# EAGLE design brushless (EAGLE 6.1)

## Sheet 1 of 2
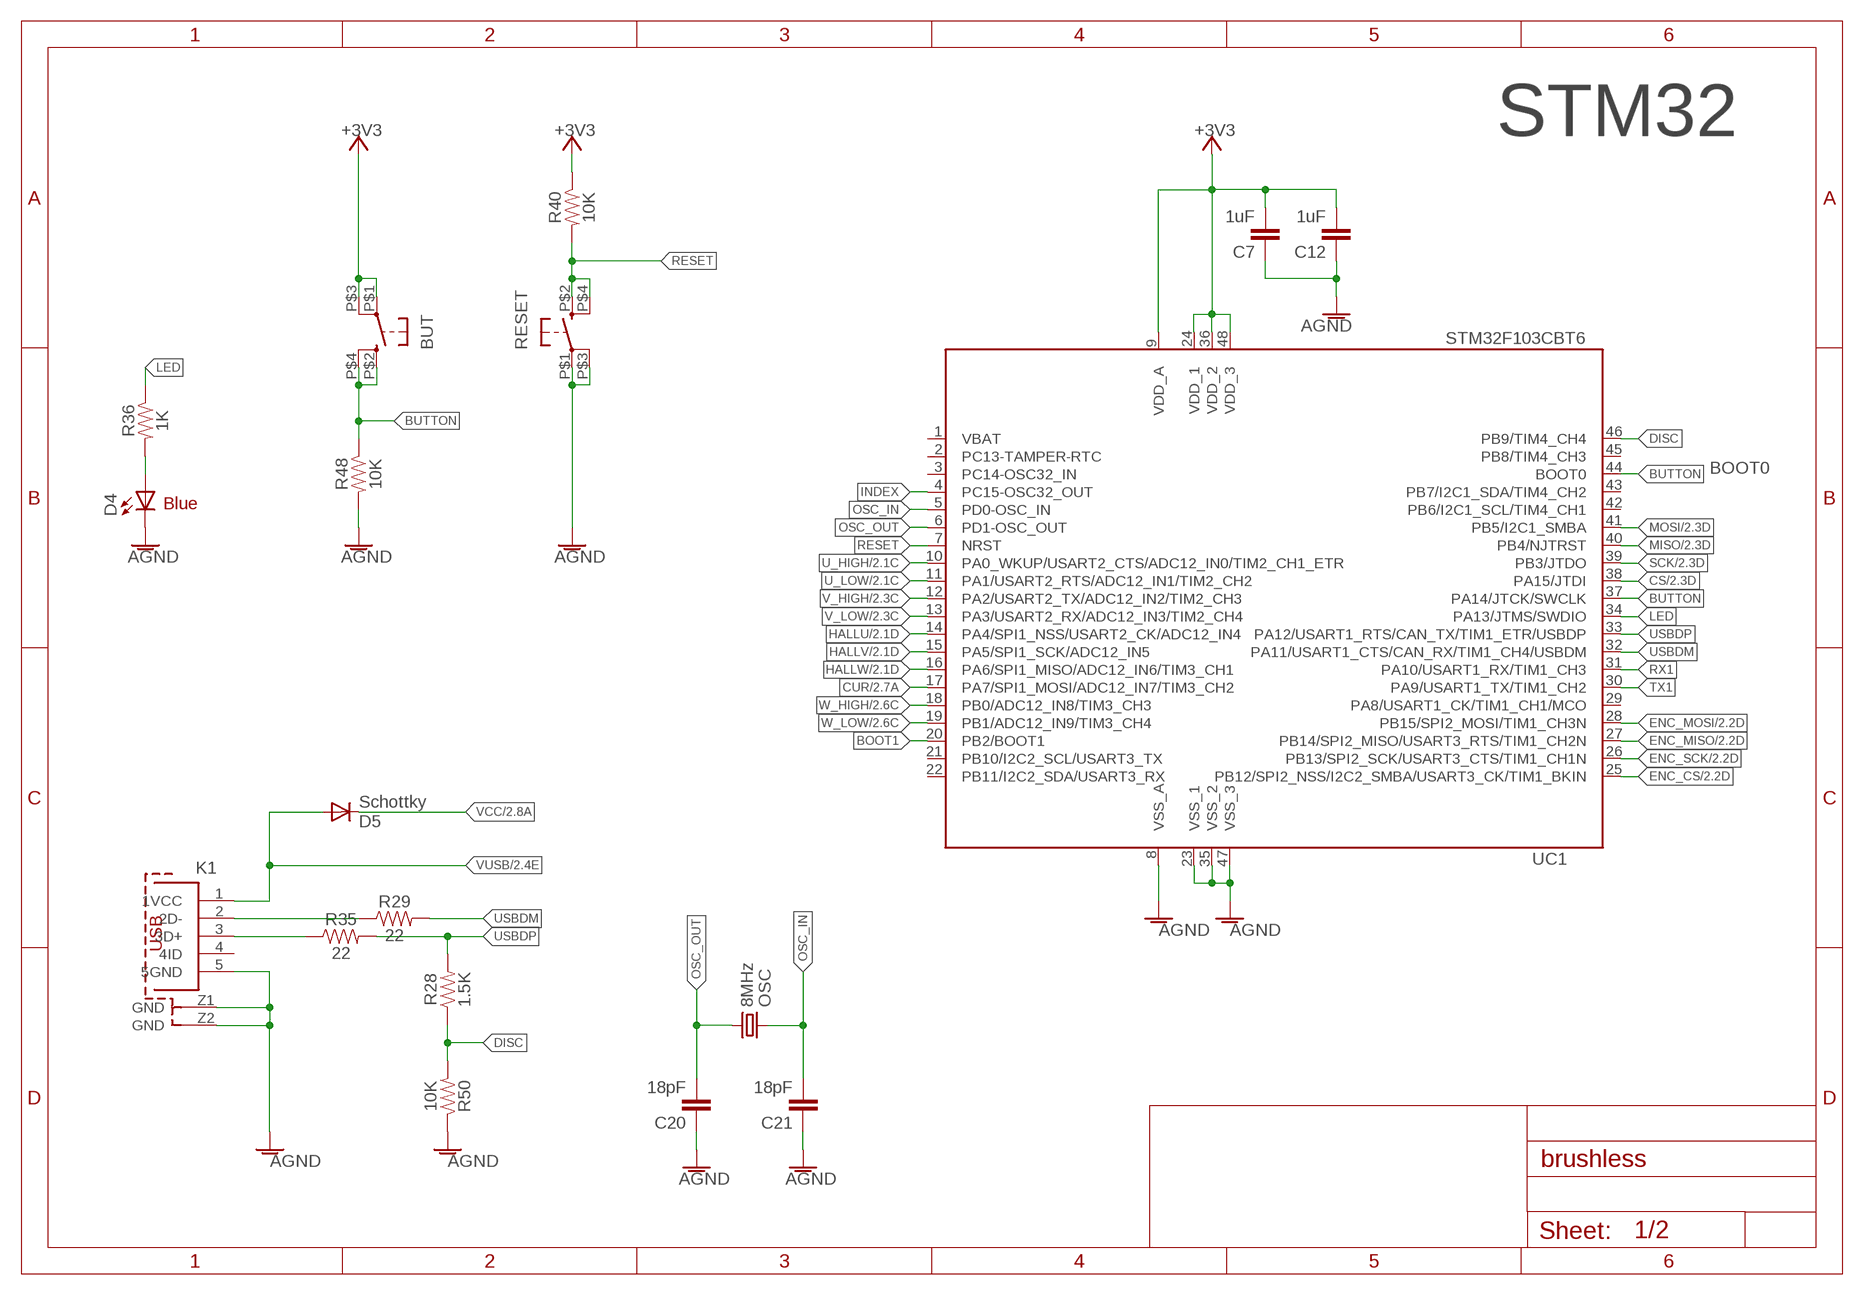
[diagram p0: schematic, sheet 1]

### Parts
BUT  KMR211GLFS  BUTTON-KMR241GLFS  [PUSHBUTTON-KMR241GLFS]
C7  1uF  CAP0805  [0805@1]
C12  1uF  CAP0805  [0805@1]
C20  18pF  CAP0805  [0805@1]
C21  18pF  CAP0805  [0805@1]
D4  Blue  LED1206  [LED-1206]
D5  Schottky  DIODESOD  [SOD-323]
K1  614105150721  [614105150721]
OSC  8MHz  CRYSTAL5X3  [CRYSTAL-SMD-5X3]
R28  1.5K  RESISTOR0805  [0805]
R29  22  RESISTOR0805  [0805]
R35  22  RESISTOR0805  [0805]
R36  1K  RESISTOR0805  [0805]
R40  10K  RESISTOR0805  [0805]
R48  10K  RESISTOR0805  [0805]
R50  10K  RESISTOR0805  [0805]
RESET  KMR211GLFS  BUTTON-KMR241GLFS  [PUSHBUTTON-KMR241GLFS]
UC1  STM32F103CBT6  STM32_STM32F103CB  [STM32_LQFP48]

### Nets
+3V3: BUT.P$1 BUT.P$3 C7.2 C12.2 R40.1 UC1.9(VDD_A) UC1.24(VDD_1) UC1.36(VDD_2) UC1.48(VDD_3) ; also sheet 2
AGND: C7.1 C12.1 C20.1 C21.1 D4.C K1.5(5GND) K1.Z1(GND) K1.Z2(GND) R48.2 R50.1 RESET.P$1 RESET.P$3 UC1.8(VSS_A) UC1.23(VSS_1) UC1.35(VSS_2) UC1.47(VSS_3) ; also sheet 2
BOOT1: UC1.20(PB2/BOOT1)
BUTTON: BUT.P$2 BUT.P$4 R48.1 UC1.37(PA14/JTCK/SWCLK) UC1.44(BOOT0)
CS: UC1.38(PA15/JTDI) ; also sheet 2
CUR: UC1.17(PA7/SPI1_MOSI/ADC12_IN7/TIM3_CH2) ; also sheet 2
DISC: R28.1 R50.2 UC1.46(PB9/TIM4_CH4)
ENC_CS: UC1.25(PB12/SPI2_NSS/I2C2_SMBA/USART3_CK/TIM1_BKIN) ; also sheet 2
ENC_MISO: UC1.27(PB14/SPI2_MISO/USART3_RTS/TIM1_CH2N) ; also sheet 2
ENC_MOSI: UC1.28(PB15/SPI2_MOSI/TIM1_CH3N) ; also sheet 2
ENC_SCK: UC1.26(PB13/SPI2_SCK/USART3_CTS/TIM1_CH1N) ; also sheet 2
HALLU: UC1.14(PA4/SPI1_NSS/USART2_CK/ADC12_IN4) ; also sheet 2
HALLV: UC1.15(PA5/SPI1_SCK/ADC12_IN5) ; also sheet 2
HALLW: UC1.16(PA6/SPI1_MISO/ADC12_IN6/TIM3_CH1) ; also sheet 2
INDEX: UC1.4(PC15-OSC32_OUT)
LED: R36.1 UC1.34(PA13/JTMS/SWDIO)
MISO: UC1.40(PB4/NJTRST) ; also sheet 2
MOSI: UC1.41(PB5/I2C1_SMBA) ; also sheet 2
N$29: D4.A R36.2
N$59: K1.2(2D-) R29.1
N$60: K1.3(3D+) R35.1
OSC_IN: C21.2 OSC.3 UC1.5(PD0-OSC_IN)
OSC_OUT: C20.2 OSC.1 UC1.6(PD1-OSC_OUT)
RESET: R40.2 RESET.P$2 RESET.P$4 UC1.7(NRST)
RX1: UC1.31(PA10/USART1_RX/TIM1_CH3)
SCK: UC1.39(PB3/JTDO) ; also sheet 2
TX1: UC1.30(PA9/USART1_TX/TIM1_CH2)
U_HIGH: UC1.10(PA0_WKUP/USART2_CTS/ADC12_IN0/TIM2_CH1_ETR) ; also sheet 2
U_LOW: UC1.11(PA1/USART2_RTS/ADC12_IN1/TIM2_CH2) ; also sheet 2
USBDM: R29.2 UC1.32(PA11/USART1_CTS/CAN_RX/TIM1_CH4/USBDM)
USBDP: R28.2 R35.2 UC1.33(PA12/USART1_RTS/CAN_TX/TIM1_ETR/USBDP)
V_HIGH: UC1.12(PA2/USART2_TX/ADC12_IN2/TIM2_CH3) ; also sheet 2
V_LOW: UC1.13(PA3/USART2_RX/ADC12_IN3/TIM2_CH4) ; also sheet 2
VCC: D5.1(C) ; also sheet 2
VUSB: D5.2(A) K1.1(1VCC) ; also sheet 2
W_HIGH: UC1.18(PB0/ADC12_IN8/TIM3_CH3) ; also sheet 2
W_LOW: UC1.19(PB1/ADC12_IN9/TIM3_CH4) ; also sheet 2
Unconnected: K1.4(4ID) UC1.2(PC13-TAMPER-RTC) UC1.3(PC14-OSC32_IN) UC1.21(PB10/I2C2_SCL/USART3_TX) UC1.22(PB11/I2C2_SDA/USART3_RX) UC1.29(PA8/USART1_CK/TIM1_CH1/MCO) UC1.42(PB6/I2C1_SCL/TIM4_CH1) UC1.43(PB7/I2C1_SDA/TIM4_CH2) UC1.45(PB8/TIM4_CH3)

### Notes on the sheet
- STM32
- BOOT0
- Blue

## Sheet 2 of 2
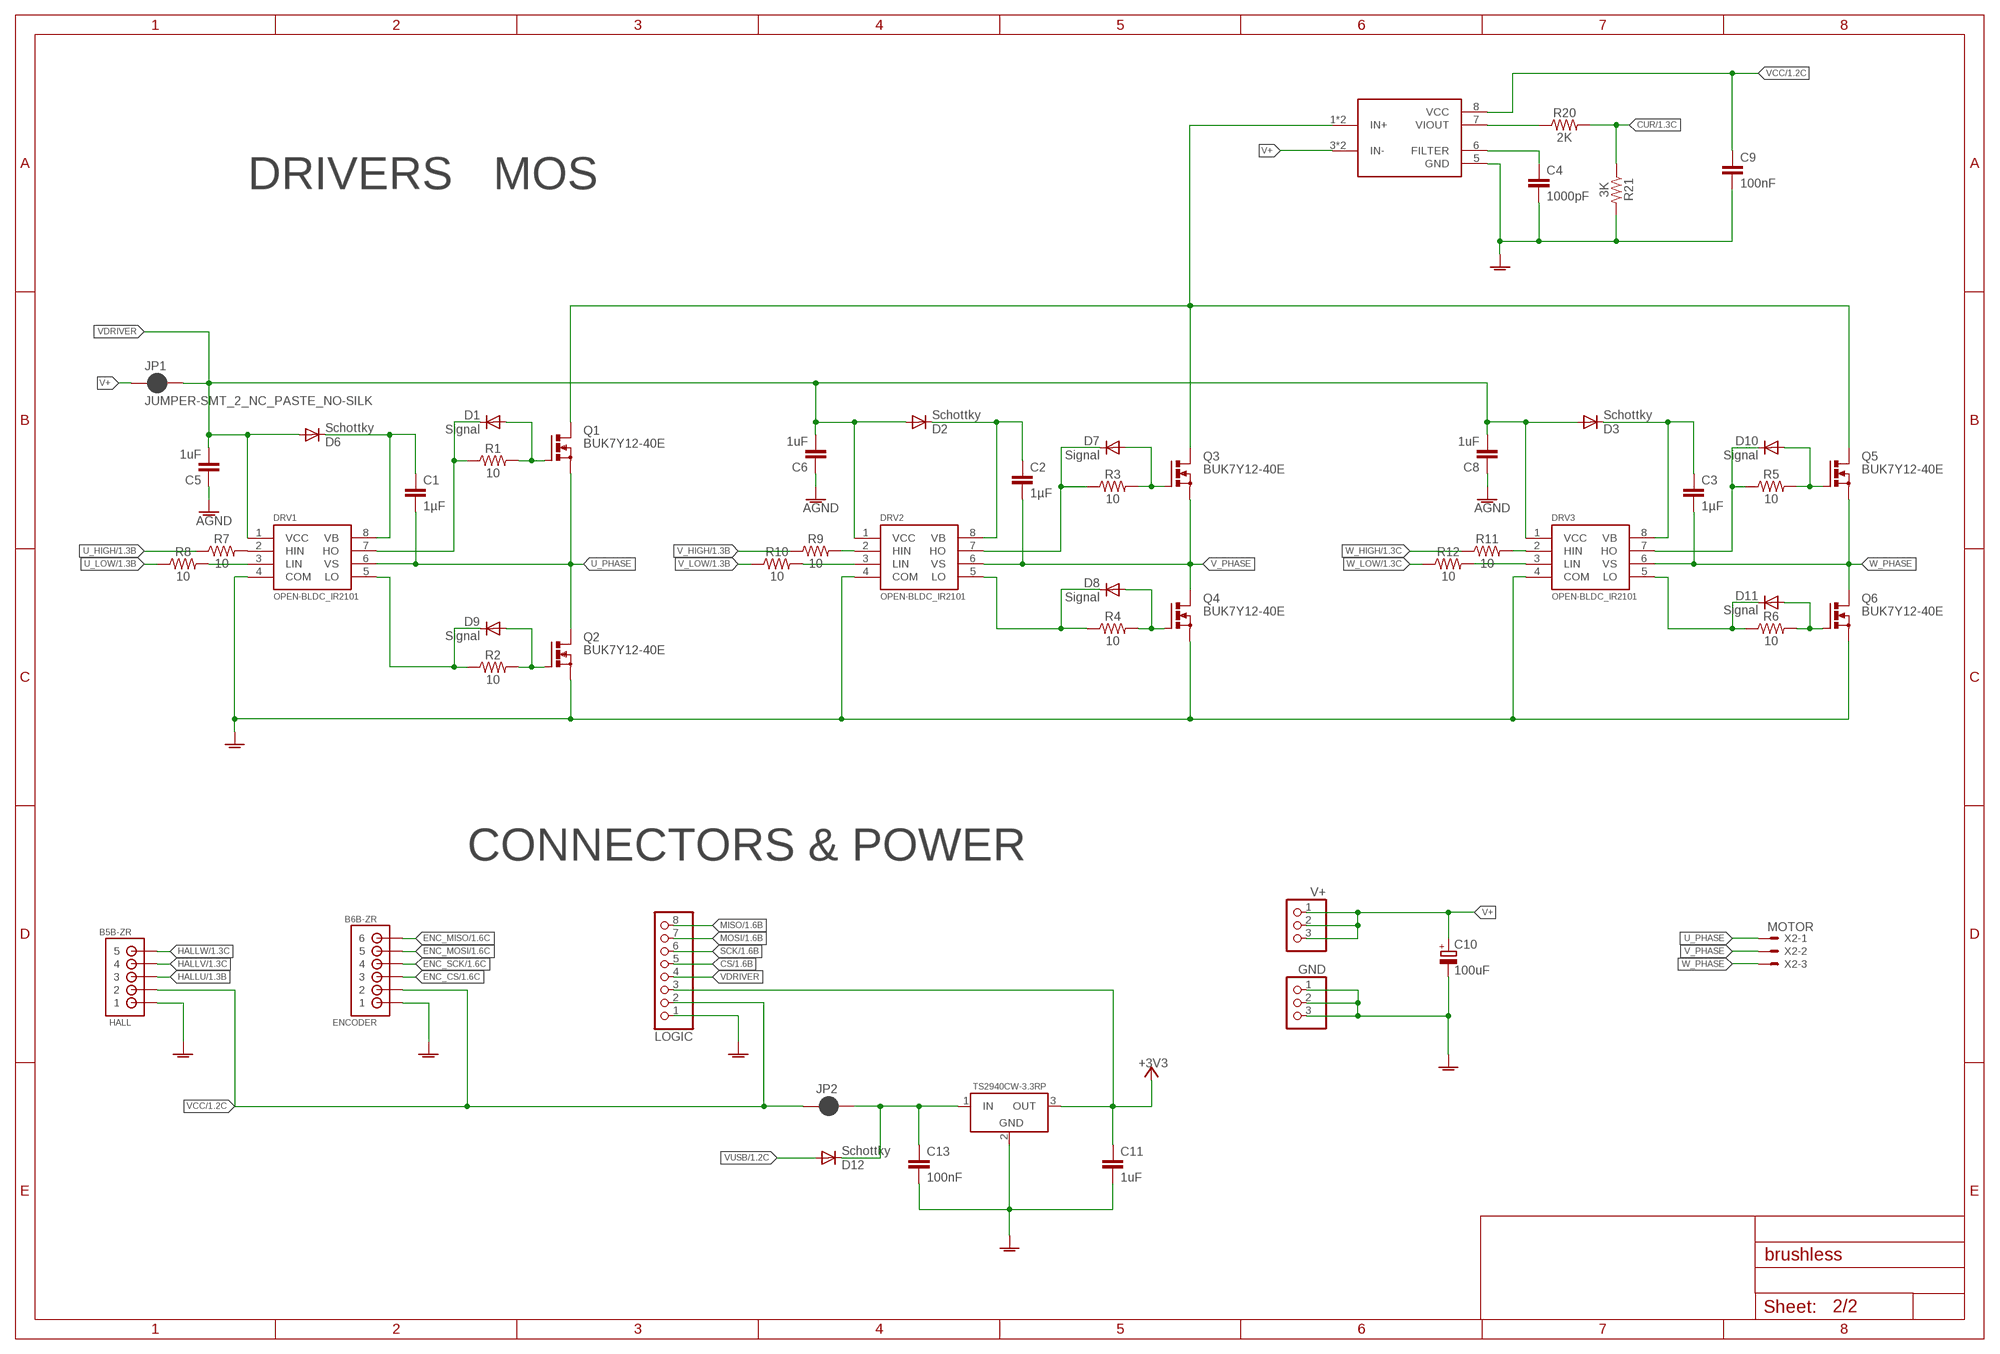
[diagram p1: schematic, sheet 2]

### Parts
C1  1µF  0.33UF/330NF-0805-50V-10%  [0805]
C2  1µF  0.33UF/330NF-0805-50V-10%  [0805]
C3  1µF  0.33UF/330NF-0805-50V-10%  [0805]
C4  1000pF  CAP0805  [0805@1]
C5  1uF  CAP0805  [0805@1]
C6  1uF  CAP0805  [0805@1]
C8  1uF  CAP0805  [0805@1]
C9  100nF  CAP0805  [0805@1]
C10  100uF  CPOL_EU_3.5-8  [E3,5-8]
C11  1uF  CAP0805  [0805@1]
C13  100nF  CAP0805  [0805@1]
D1  Signal  DIODESOD  [SOD-323]
D2  Schottky  DIODESOD  [SOD-323]
D3  Schottky  DIODESOD  [SOD-323]
D6  Schottky  DIODESOD  [SOD-323]
D7  Signal  DIODESOD  [SOD-323]
D8  Signal  DIODESOD  [SOD-323]
D9  Signal  DIODESOD  [SOD-323]
D10  Signal  DIODESOD  [SOD-323]
D11  Signal  DIODESOD  [SOD-323]
D12  Schottky  DIODESOD  [SOD-323]
DRV1  OPEN-BLDC_IR2101  [OPEN-BLDC_SO-8]
DRV2  OPEN-BLDC_IR2101  [OPEN-BLDC_SO-8]
DRV3  OPEN-BLDC_IR2101  [OPEN-BLDC_SO-8]
ENCODER  B6B-ZR  [B6B-ZR]
GND  CONNEC_1X03  [CONNEC_1X03]
HALL  B5B-ZR  [B5B-ZR]
JP1  JUMPER-SMT_2_NC_PASTE_NO-SILK  [SMT-JUMPER_2_NC_PASTE_NO-SILK]
JP2  JUMPER-SMT_2_NC_PASTE_NO-SILK  [SMT-JUMPER_2_NC_PASTE_NO-SILK]
LOGIC  CONNEC_1X08  [CONNEC_1X08]
Q1  BUK7Y12-40E  [SOT669]
Q2  BUK7Y12-40E  [SOT669]
Q3  BUK7Y12-40E  [SOT669]
Q4  BUK7Y12-40E  [SOT669]
Q5  BUK7Y12-40E  [SOT669]
Q6  BUK7Y12-40E  [SOT669]
R1  10  RESISTOR0805  [0805]
R2  10  RESISTOR0805  [0805]
R3  10  RESISTOR0805  [0805]
R4  10  RESISTOR0805  [0805]
R5  10  RESISTOR0805  [0805]
R6  10  RESISTOR0805  [0805]
R7  10  RESISTOR0805  [0805]
R8  10  RESISTOR0805  [0805]
R9  10  RESISTOR0805  [0805]
R10  10  RESISTOR0805  [0805]
R11  10  RESISTOR0805  [0805]
R12  10  RESISTOR0805  [0805]
R20  2K  RESISTOR0805  [0805]
R21  3K  RESISTOR0805  [0805]
REG1  TS2940CW-3.3RP  [SOT223]
SENSE  ACS712  [SO8]
V+  CONNEC_1X03  [CONNEC_1X03]
X2  MOTOR  JST-XH-03-PIN-LONG-PAD  [JST-XH-03-PACKAGE-LONG-PAD]

### Nets
+3V3: C11.1 LOGIC.3 REG1.3(OUT) ; also sheet 1
AGND: C4.2 C5.1 C6.1 C8.1 C9.2 C10.- C11.2 C13.2 DRV1.4(COM) DRV2.4(COM) DRV3.4(COM) ENCODER.1 GND.1 GND.2 GND.3 HALL.1 LOGIC.1 Q2.1(S) Q2.2(S) Q2.3(S) Q4.1(S) Q4.2(S) Q4.3(S) Q6.1(S) Q6.2(S) Q6.3(S) R21.2 REG1.2(GND) SENSE.5(GND) ; also sheet 1
CS: LOGIC.5 ; also sheet 1
CUR: R20.2 R21.1 ; also sheet 1
ENC_CS: ENCODER.3 ; also sheet 1
ENC_MISO: ENCODER.6 ; also sheet 1
ENC_MOSI: ENCODER.5 ; also sheet 1
ENC_SCK: ENCODER.4 ; also sheet 1
HALLU: HALL.3 ; also sheet 1
HALLV: HALL.4 ; also sheet 1
HALLW: HALL.5 ; also sheet 1
MISO: LOGIC.8 ; also sheet 1
MOSI: LOGIC.7 ; also sheet 1
N$2: D7.2(A) Q3.4(G) R3.2
N$3: D9.2(A) Q2.4(G) R2.2
N$4: DRV1.2(HIN) R7.2
N$5: C1.1 D6.1(C) DRV1.8(VB)
N$6: D8.2(A) Q4.4(G) R4.2
N$7: D10.2(A) Q5.4(G) R5.2
N$8: DRV1.3(LIN) R8.2
N$9: D11.2(A) Q6.4(G) R6.2
N$10: C2.1 D2.1(C) DRV2.8(VB)
N$11: D1.2(A) Q1.4(G) R1.2
N$12: D10.1(C) DRV3.7(HO) R5.1
N$13: D11.1(C) DRV3.5(LO) R6.1
N$14: DRV2.3(LIN) R10.2
N$15: C3.1 D3.1(C) DRV3.8(VB)
N$16: DRV2.2(HIN) R9.2
N$17: DRV3.2(HIN) R11.2
N$18: DRV3.3(LIN) R12.2
N$22: C13.1 D12.1(C) JP2.2 REG1.1(IN)
N$24: R20.1 SENSE.7(VIOUT)
N$27: C4.1 SENSE.6(FILTER)
SCK: LOGIC.6 ; also sheet 1
U_GATE_HIGH: D1.1(C) DRV1.7(HO) R1.1
U_GATE_LOW: D9.1(C) DRV1.5(LO) R2.1
U_HIGH: R7.1 ; also sheet 1
U_LOW: R8.1 ; also sheet 1
U_PHASE [power]: C1.2 DRV1.6(VS) Q1.1(S) Q1.2(S) Q1.3(S) Q2.MB(D) X2.1
V+ [vdriver]: C10.+ JP1.1 SENSE.3(IN-) SENSE.4(IN-) V+.1 V+.2 V+.3
V+_MOS [power]: Q1.MB(D) Q3.MB(D) Q5.MB(D) SENSE.1(IN+) SENSE.2(IN+)
V_GATE_HIGH: D7.1(C) DRV2.7(HO) R3.1
V_GATE_LOW: D8.1(C) DRV2.5(LO) R4.1
V_HIGH: R9.1 ; also sheet 1
V_LOW: R10.1 ; also sheet 1
V_PHASE [power]: C2.2 DRV2.6(VS) Q3.1(S) Q3.2(S) Q3.3(S) Q4.MB(D) X2.2
VCC: C9.1 ENCODER.2 HALL.2 JP2.1 LOGIC.2 SENSE.8(VCC) ; also sheet 1
VDRIVER [vdriver]: C5.2 C6.2 C8.2 D2.2(A) D3.2(A) D6.2(A) DRV1.1(VCC) DRV2.1(VCC) DRV3.1(VCC) JP1.2 LOGIC.4
VUSB: D12.2(A) ; also sheet 1
W_HIGH: R11.1 ; also sheet 1
W_LOW: R12.1 ; also sheet 1
W_PHASE [power]: C3.2 DRV3.6(VS) Q5.1(S) Q5.2(S) Q5.3(S) Q6.MB(D) X2.3

### Notes on the sheet
- DRIVERS | MOS
- CONNECTORS & POWER

## Power pins joined to a net without a drawn wire
VBAT: UC1.1(VBAT)

## Library data of the parts
BUT RESET = okie:BUTTON-KMR241GLFS; FARNELL: 1437637
C1-C3 = SparkFun-Capacitors:0.33UF/330NF: 0.33µF/330nF ceramic capacitors A capacitor is a passive two-terminal electrical component used to store electrical energy temporarily in an electric field.; FARNELL: 2496946; PROD_ID: CAP-08469; VALUE: 0.33µF
C4 = SparkFun-Passives:CAP: Capacitor Standard 0603 ceramic capacitor, and 0.1" leaded capacitor.; FARNELL: 2392334
C5-C8 C11 C12 = SparkFun-Passives:CAP: Capacitor Standard 0603 ceramic capacitor, and 0.1" leaded capacitor.; FARNELL: 2496946
C9 C13 = SparkFun-Passives:CAP: Capacitor Standard 0603 ceramic capacitor, and 0.1" leaded capacitor.; FARNELL: 1759143RL
C10 = rhoban:CPOL_EU: 47uF: http://fr.farnell.com/panasonic-electronic-components/eee1ca470sp/condensateur-elec-alu-47uf-16v/dp/9696946 220uF: http://fr.farnell.com/panasonic-electronic-components/eeefk1c221xp/condensateur-elec-alu-220uf-16v/dp/1850103; FARNELL: 1870964
C20 C21 = SparkFun-Passives:CAP: Capacitor Standard 0603 ceramic capacitor, and 0.1" leaded capacitor.; FARNELL: 1414620
D1 D7-D11 = SparkFun-DiscreteSemi:DIODE: Diode These are standard reverse protection diodes and small signal diodes. SMA package can handle up to about 1A. SOD-323 can handle about 200mA. What the SOD-323 package when ordering, there are some mfgs out there that are 5-pin packages.; FARNELL: 1843678RL
D2 D3 D5 D6 D12 = SparkFun-DiscreteSemi:DIODE: Diode These are standard reverse protection diodes and small signal diodes. SMA package can handle up to about 1A. SOD-323 can handle about 200mA. What the SOD-323 package when ordering, there are some mfgs out there that are 5-pin packages.; FARNELL: 8734593
D4 = SparkFun:LED: LEDs Standard schematic elements and footprints for 5mm, 3mm, 1206, and 0603 sized LEDs. 5mm - Spark Fun Electronics SKU : COM-00529 (and others); FARNELL: 1581233
DRV1-DRV3 = rhoban:OPEN-BLDC_IR2101; FARNELL: 8638756
ENCODER = jst:B6B-ZR: JST-ZH Connector 6 pol, 1.5mm pitch Package: B6B-ZR Source: http://www.jst-mfg.com/product/pdf/eng/eZH.pdf; FARNELL: -
GND V+ = rhoban:CONNEC_1X03; FARNELL: 1022248
HALL = jst:B5B-ZR: JST-ZH Connector 5 pol, 1.5mm pitch Package: B5B-ZR Source: http://www.jst-mfg.com/product/pdf/eng/eZH.pdf; FARNELL: -
JP1 JP2 = SparkFun-Jumpers:JUMPER-SMT_2_NC_PASTE: Normally closed solder jumper This jumper has an aperture in the stencil to allow solder paste to bridge the split in the wire so it's normally closed (NC). Wick off the solder to open the connection. Reapply solder to reclose the connection.; FARNELL: -
K1 = rhoban:614105150721: WR-COM_USB_Micro Type B_Vertical_THT; Micro Type B Vertical THT- Tape & Reel not for Pick & Place machine Code : Con_I-O_COM_USB_2.0_B_614105150721_614105150721 <http://katalog.we-online.de/media/images/eican/Con_I-O_COM_USB_2.0_B_614105150721_pf2.jpg> Details see: http://katalog.we-online.de/em/datasheet/614105150721.pdf Created 12/08/2014, Dan Xu 2014 (C) Wurth Elektronik; FARNELL: 2470821
LOGIC = rhoban:CONNEC_1X08; FARNELL: 1022256
OSC = SparkFun2:CRYSTAL: Crystals Various standard crystals. Proven footprints. Spark Fun Electronics SKU : COM-00534; FARNELL: 2467818
Q1-Q6 = transistor-power:BUK7Y12-40E; FARNELL: 2319916
R1-R12 = SparkFun-Resistors:RESISTOR: Generic Resistor Package; FARNELL: 2498048
R20 = SparkFun-Resistors:RESISTOR: Generic Resistor Package; FARNELL: 2446939
R21 = SparkFun-Resistors:RESISTOR: Generic Resistor Package; FARNELL: 2446965
R28 = SparkFun-Resistors:RESISTOR: Generic Resistor Package; FARNELL: 2446909
R29 R35 = SparkFun-Resistors:RESISTOR: Generic Resistor Package; FARNELL: 2446926
R36 = SparkFun-Resistors:RESISTOR: Generic Resistor Package; FARNELL: 2446904
R40 R48 R50 = SparkFun-Resistors:RESISTOR: Generic Resistor Package; FARNELL: 2447553
REG1 = rhoban:TS2940CW-3.3RP; FARNELL: 7261403
SENSE = rhoban:ACS712; FARNELL: 1329624
UC1 = rhoban:STM32_STM32F103CB; FARNELL: 1606327
X2 = Rembrandt Electronics - JST XH Connectors v1-0:JST-XH-03-PIN: JST XH Connector 2 Pin Wire to board connector. Pitch: 2,54 mm, (0.100") Number of pins: 3 Created by Rembrandt Electronics www.rembrandtelectronics.com; FARNELL: -

## Net classes
1 vdriver: width 0.254 mm

## Board
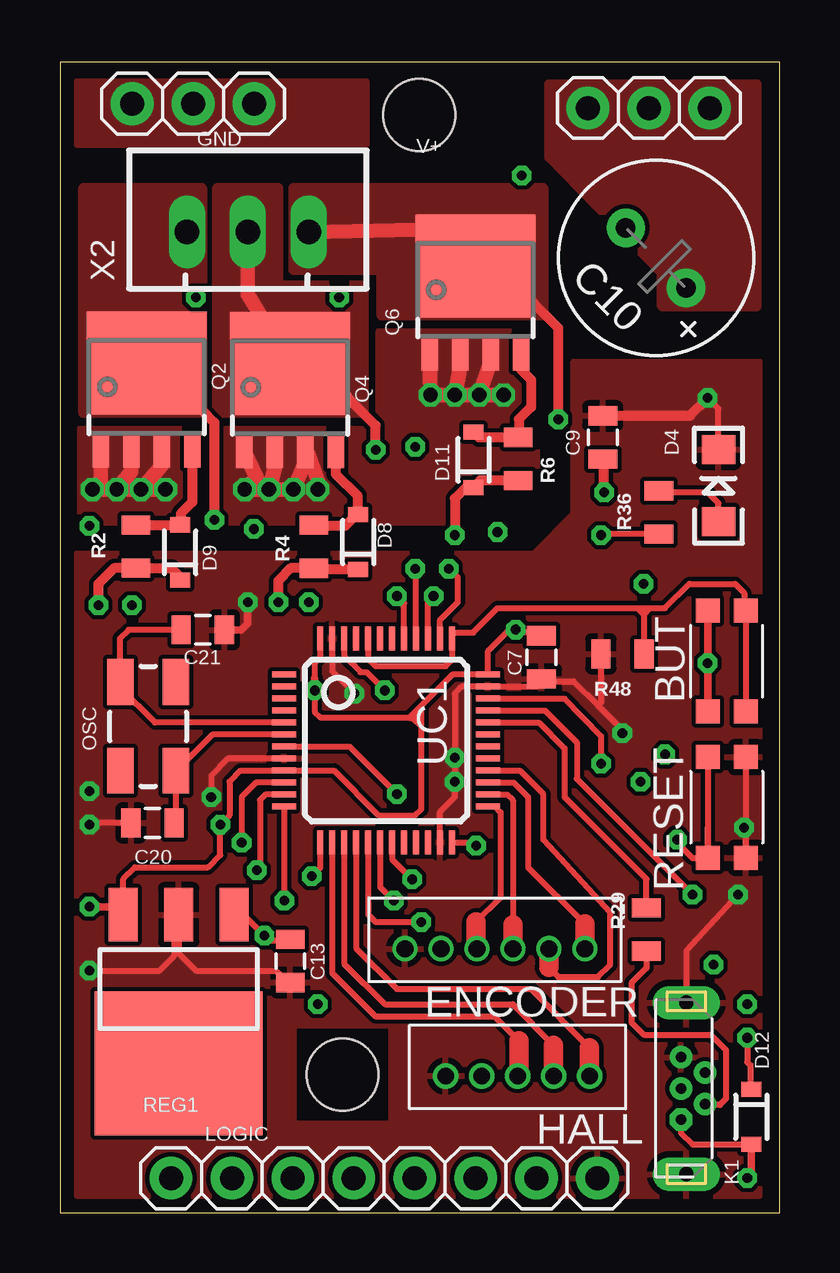
[diagram p2: board, top side]
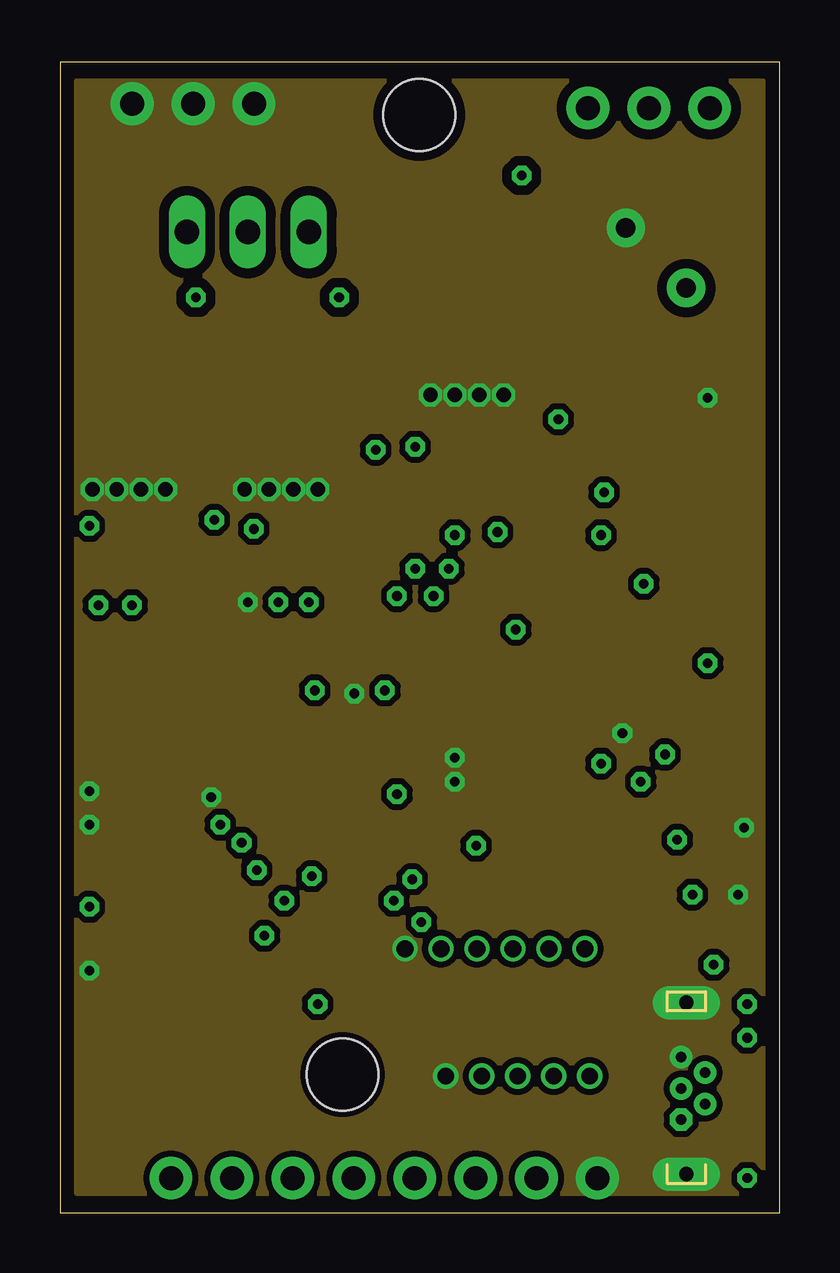
[diagram p3: board, inner layer Route2]
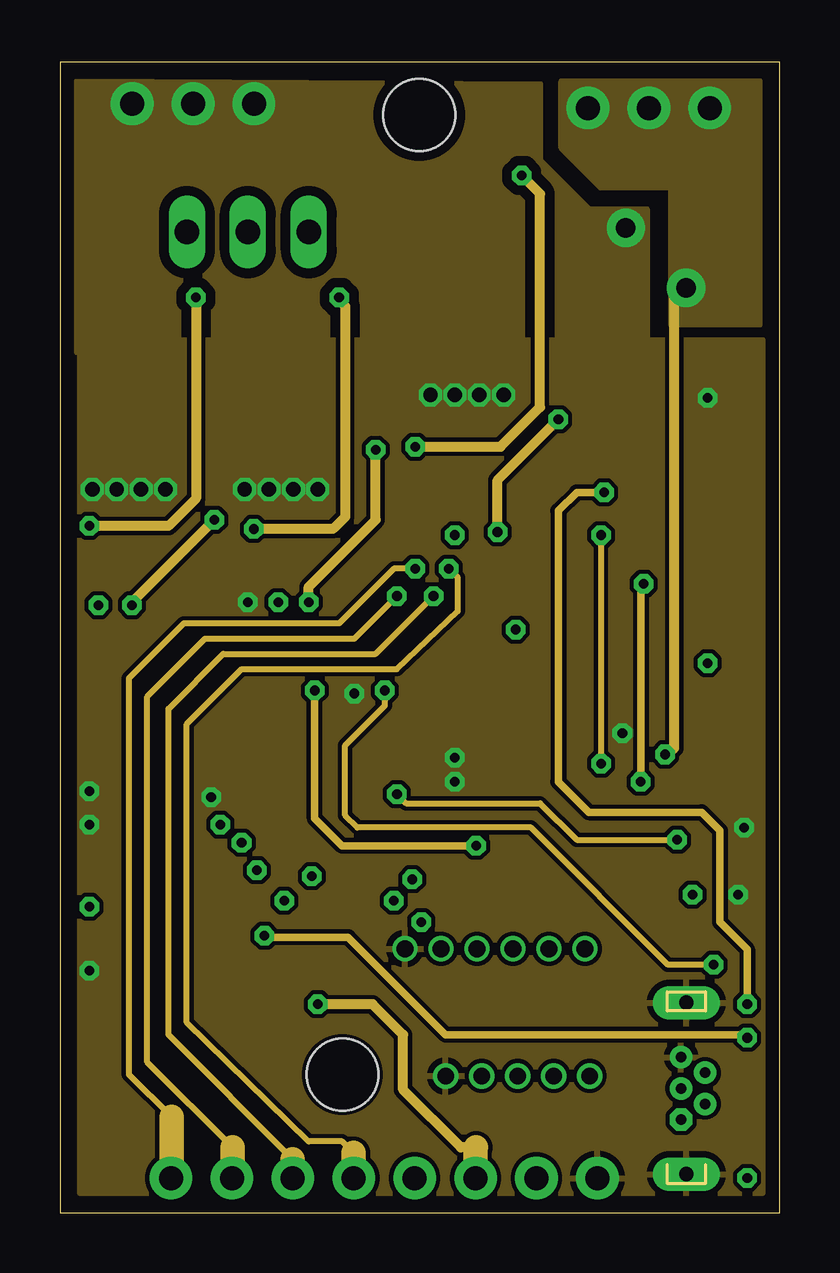
[diagram p4: board, inner layer Route15]
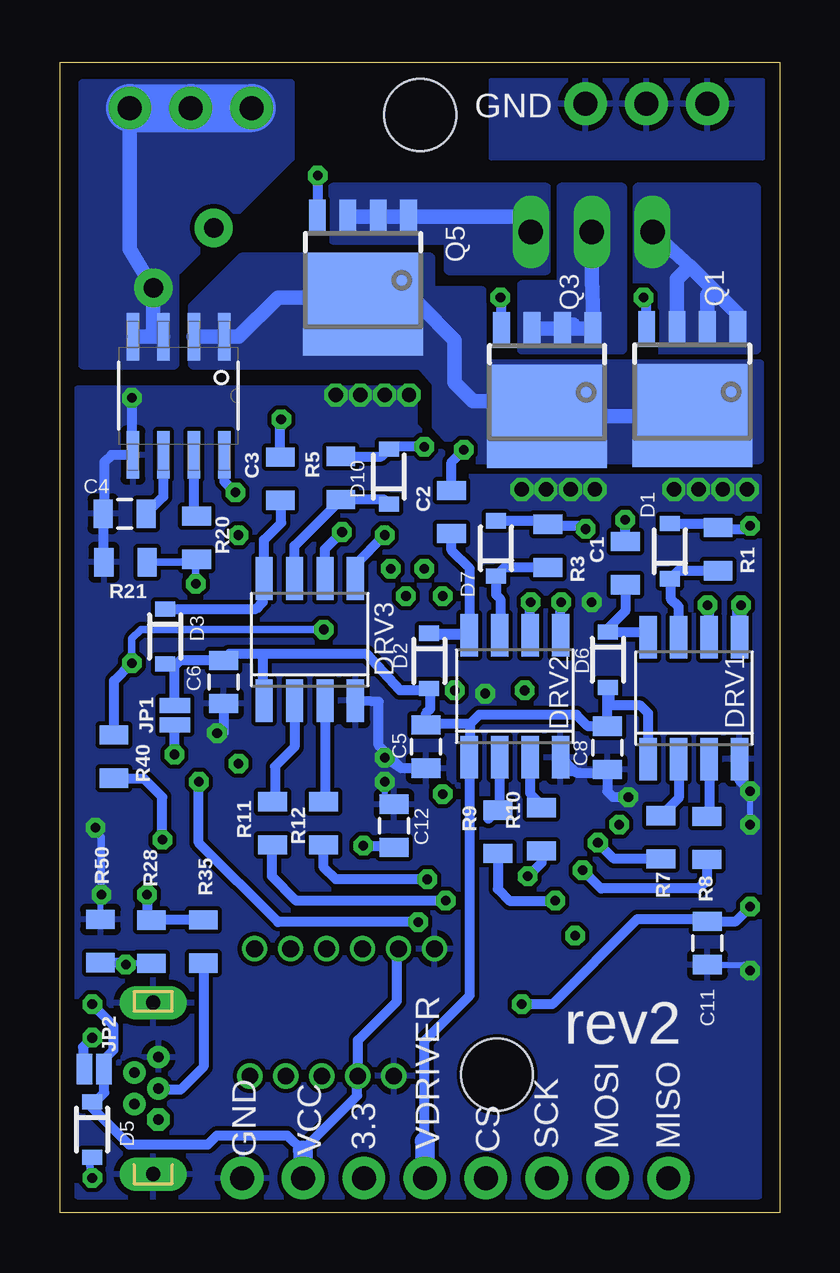
[diagram p5: board, bottom side, seen from below]

Size 30 x 47.97 mm. Coordinates in mm from the lower left corner, seen from the top.
Outline: 0,0 30,0 30,47.97 0,47.97 0,0
Copper layers (1*2*15*16): Top 0.035559375mm / dielectric 0.47751875mm / Route2 0.035559375mm / dielectric 0.47751875mm / Route15 0.035559375mm / dielectric 0.47751875mm / Bottom 0.035559375mm
Design rules: minimum track width 7mil, minimum drill 15mil, track to track 7mil, track to pad 7mil, pad to pad 7mil, via to via 7mil, smd to smd 7mil, copper to edge 7mil, drill to drill 7mil, minimum pad ring 7mil, minimum via ring 7mil, stop-mask expansion 4mil, vias tented up to drill 25mil, thermal gap 10mil
Holes 3 mm at 14.98,45.77 11.78,5.77
tKeepout: 4 lines
tRestrict: area 13.1,43.9 to 16.9,47.7; area 9.9,3.9 to 13.7,7.7
bRestrict: area 13.1,43.9 to 16.9,47.7

### Footprints (pad centres in the part's own frame; a part is rotated, then mirrored left to right if it is on the bottom)
PUSHBUTTON-KMR241GLFS = smd 1 x 1: P$1 2.1,0.8; P$2 2.1,-0.8; P$3 -2.1,0.8; P$4 -2.1,-0.8
0805 = smd 0.8 x 1.2: 1 -0.9,0; 2 0.9,0
0805@1 = smd 0.8 x 1.2: 1 -0.9,0; 2 0.9,0
E3,5-8 = drill 0.813 pad 1.6: + -1.778,0; - 1.778,0
SOD-323 = smd 0.63 x 0.83: 1 -1.15,0; 2 1.15,0
LED-1206 = smd 1.2 x 1.4: A -1.5,0; C 1.5,0
OPEN-BLDC_SO-8 = smd 0.72 x 1.78: 1 -1.905,-2.543; 2 -0.635,-2.543; 3 0.635,-2.543; 4 1.905,-2.543; 5 1.905,2.543; 6 0.635,2.543; 7 -0.635,2.543; 8 -1.905,2.543
B6B-ZR = drill 0.7: 1 9,-1.3; 2 7.5,-1.3; 3 6,-1.3; 4 4.5,-1.3; 5 3,-1.3; 6 1.5,-1.3
CONNEC_1X03 = drill 1 pad 1.778: 1 -5.08,0; 2 -2.54,0; 3 0,0
B5B-ZR = drill 0.7: 1 7.5,-1.3; 2 6,-1.3; 3 4.5,-1.3; 4 3,-1.3; 5 1.5,-1.3
SMT-JUMPER_2_NC_PASTE_NO-SILK = smd 0.635 x 1.27: 1 -0.406,0; 2 0.406,0
614105150721 = drill 0.44 pad 0.94 octagon: 1 2.275,0.22 | drill 0.44 pad 0.94: 2 2.925,-0.78; 3 3.575,0.22; 4 4.225,-0.78; 5 4.875,0.22 | drill 0.6 pad 1.4 long: Z1 0,0; Z2 7.15,0
CONNEC_1X08 = drill 1 pad 1.778: 1 -17.78,0; 2 -15.24,0; 3 -12.7,0; 4 -10.16,0; 5 -7.62,0; 6 -5.08,0; 7 -2.54,0; 8 0,0
CRYSTAL-SMD-5X3 = smd 1.9 x 1.1: 1 -1.85,-1.15; 2 1.85,-1.15; 3 1.85,1.15; 4 -1.85,1.15
SOT669 = smd 0.7 x 1.4: 1 -1.905,-2.65; 2 -0.635,-2.65; 3 0.635,-2.65; 4 1.905,-2.65 | smd 5 x 4.3: MB 0,1
SOT223 = smd 1.219 x 2.235: 1 -2.311,-3.099; 2 0,-3.099; 3 2.311,-3.099 | smd 7 x 6: 4 0,3.099
SO8 = smd 1.981 x 0.533: 1 -2.464,1.905; 2 -2.464,0.635; 3 -2.464,-0.635; 4 -2.464,-1.905; 5 2.464,-1.905; 6 2.464,-0.635; 7 2.464,0.635; 8 2.464,1.905
STM32_LQFP48 = smd 0.25 x 1: 1 -2.75,-4.25; 2 -2.25,-4.25; 3 -1.75,-4.25; 4 -1.25,-4.25; 5 -0.75,-4.25; 6 -0.25,-4.25; 7 0.25,-4.25; 8 0.75,-4.25; 9 1.25,-4.25; 10 1.75,-4.25; 11 2.25,-4.25; 12 2.75,-4.25; 25 2.75,4.25; 26 2.25,4.25; 27 1.75,4.25; 28 1.25,4.25; 29 0.75,4.25; 30 0.25,4.25; 31 -0.25,4.25; 32 -0.75,4.25; 33 -1.25,4.25; 34 -1.75,4.25; 35 -2.25,4.25; 36 -2.75,4.25 | smd 1 x 0.25: 13 4.25,-2.75; 14 4.25,-2.25; 15 4.25,-1.75; 16 4.25,-1.25; 17 4.25,-0.75; 18 4.25,-0.25; 19 4.25,0.25; 20 4.25,0.75; 21 4.25,1.25; 22 4.25,1.75; 23 4.25,2.25; 24 4.25,2.75; 37 -4.25,2.75; 38 -4.25,2.25; 39 -4.25,1.75; 40 -4.25,1.25; 41 -4.25,0.75; 42 -4.25,0.25; 43 -4.25,-0.25; 44 -4.25,-0.75; 45 -4.25,-1.25; 46 -4.25,-1.75; 47 -4.25,-2.25; 48 -4.25,-2.75
JST-XH-03-PACKAGE-LONG-PAD = drill 1.016 long: 1 -2.54,0; 2 0,0; 3 2.54,0

### Placement (x,y rotation side)
BUT  27.8,23 90 top
C1  6.43,27.09 90 bottom
C2  13.67,29.22 90 bottom
C3  20.81,30.61 90 bottom
C4  27.3,29.15 180 bottom
C5  14.73,19.44 90 bottom
C6  23.18,22.13 90 bottom
C7  1uF  [0805]  20.08,23.16 90 top
C8  7.18,19.39 90 bottom
C9  22.63,32.33 90 top
C10  24.85,39.81 135 top
C11  3,11.25 270 bottom
C12  1uF  [0805]  16.07,16.14 270 bottom
C13  9.6,10.51 270 top
C20  18pF  [0805]  3.86,16.26 0 top
C21  18pF  [0805]  5.96,24.31 180 top
D1  4.57,27.58 90 bottom
D2  14.61,23.01 270 bottom
D3  25.62,24.03 270 bottom
D4  27.45,30.32 90 top
D5  28.66,3.48 270 bottom
D6  7.15,23.06 270 bottom
D7  11.82,27.7 90 bottom
D8  12.44,27.97 90 top
D9  5.01,27.54 90 top
D10  16.29,30.7 90 bottom
D11  17.25,31.4 90 top
D12  28.82,4.01 270 top
DRV1  3.57,21.46 0 bottom
DRV2  11.03,21.54 0 bottom
DRV3  19.59,23.9 0 bottom
ENCODER  23.38,9.71 180 top
GND  3.01,46.24 180 top
HALL  23.58,4.41 180 top
JP1  25.22,20.75 90 bottom
JP2  28.57,6.01 180 bottom
K1  26.11,1.62 90 top
LOGIC  4.63,1.46 180 top
OSC  3.68,20.28 90 top
Q1  3.64,34.24 180 bottom
Q2  3.61,34.43 0 top
Q3  9.69,34.21 180 bottom
Q4  9.59,34.41 0 top
Q5  17.37,38.88 180 bottom
Q6  17.32,38.47 0 top
R1  2.57,27.67 90 bottom
R2  3.17,27.78 90 top
R3  9.65,27.81 90 bottom
R4  10.59,27.77 90 top
R5  18.29,30.64 90 bottom
R6  19.11,31.43 90 top
R7  4.95,15.66 90 bottom
R8  3.04,15.63 90 bottom
R9  11.74,15.89 90 bottom
R10  9.93,15.99 90 bottom
R11  21.14,16.25 90 bottom
R12  19.01,16.25 90 bottom
R20  24.31,28.15 270 bottom
R21  27.26,27.12 180 bottom
R28  26.19,11.3 90 bottom
R29  24.45,11.81 90 top
R35  24.02,11.31 90 bottom
R36  24.96,29.2 90 top
R40  27.75,19.02 270 bottom
R48  23.46,23.31 180 top
R50  28.31,11.34 270 bottom
REG1  4.95,9.33 180 top
RESET  27.8,16.91 270 top
SENSE  25.05,34.06 270 bottom
UC1  13.6,19.69 270 top
V+  22.01,46.06 180 top
X2  7.83,40.89 0 top

### Tracks (layer width: path | path; a pad name or v marks a point on that pad's centre or on a via)
+3V3  (via drill 0.4 pad 0.81)
  Top 0.254: UC1.48 10.85,23.15 10.62,22.92 10.62,22.29 | v10.62,21.78 10.62,20.89 10.88,20.64 14.56,20.64 | 15.07,20.64 14.69,20.64 | 15.07,21.14 16.36,22.44 UC1.36 17.85,23.42 18.75,24.32 v19,24.32 19.13,24.19 19.95,24.19 C7.2 | 2.75,12.76 2.75,12.64 2.64,12.53 REG1.3 2.64,13.92 3.13,14.41 6.18,14.41 6.68,14.92 v6.68,16.19 7.07,16.57 7.07,17.97 7.53,18.44 UC1.9 11.42,18.44 13.29,16.57 14.81,16.57 15.07,16.83 15.07,20.26 | 2.75,12.76 2.75,13.02 2.62,13.14 | 2.62,13.14 2.62,13.27 | 2.62,13.14 2.62,12.89 2.75,12.76 | UC1.24 17.22,15.44 v17.35,15.3 | 15.07,20.64 15.07,21.14 | 15.07,21.14 14.56,20.64 | 14.56,20.64 14.69,20.64 | 14.69,20.64 15.07,20.26 | 15.07,20.26 15.07,20.64 | 15.07,20.64 14.94,20.76
  Top 0.305: BUT.P$1 BUT.P$3 v27,22.92 | v1.22,12.76 2.75,12.76 | v10.62,21.78 10.62,22.29
  Route15 0.305: v17.35,15.3 11.76,15.3 10.62,16.45 v10.62,21.78
  Route15 0.406: 17.35,2.73 16.72,2.73 14.3,5.14 14.3,7.43 13.03,8.7 v10.75,8.7
  Route15 1.016: LOGIC.3 17.33,2.71 17.35,2.73
  Bottom 0.254: C12.2 16.02,14.98
  Bottom 0.305: v27,22.92 27,23.94 26.62,24.32 v19,24.32 | v1.22,12.76 1.35,12.76 1.35,12.51 | C11.1 2.64,12.16
  Bottom 0.406: R40.1 27.75,22.18 v27,22.92 | v1.22,12.76 1.82,12.16 2.64,12.16 | v10.75,8.7 9.48,8.7 5.92,12.26 3.11,12.26 C11.1 2.73,12.15 2.75,12.13 | v17.35,15.3 16.49,15.3 UC1.24 16.27,15.44 C12.2
AGND  (via drill 0.4 pad 0.81, 0.6)
  Top 0.254: 8.4,18.94 UC1.8 7.02,18.94 6.3,18.22 v6.3,17.34 | C20.1 1.29,16.26 v1.22,16.19 | v16.46,18.99 16.49,18.63 16.49,17.84 v16.46,17.97 16.46,17.34 15.85,16.72 UC1.23 | v16.46,18.99 16.46,21.65 16.75,21.94 UC1.35 19.92,21.94 20.15,22.16 | 16.46,18.86 v16.46,18.99 | v1.22,10.1 4.14,10.1 4.78,10.73 4.78,12.26 REG1.2 4.95,10.81 5.67,10.1 8.98,10.1 C13.2 | v28.27,13.27 26.11,10.93 K1.Z2 | D4.C 27.45,33.52 v27,33.97 | 20.15,22.16 21.42,22.16 22.43,21.14 | 22.43,21.14 23.45,20.13 v23.45,20 | RESET.P$3 RESET.P$1 28.6,15.99 v28.53,16.06 | C7.1 20.08,22.23 20.15,22.16 | R48.2 22.56,21.27 22.43,21.14 | UC1.47 11.35,22.57 v12.27,21.65
  Top 0.305: C21.1 7.56,24.31 7.83,24.57 v7.83,25.46 7.95,25.46
  Top 0.406: C9.2 26.26,33.23 v27,33.97
  Top 0.61: Q2.1 1.71,30.31 v1.35,30.16 v2.37,30.16 | Q2.2 2.98,30.9 v2.37,30.16 | Q2.3 4.25,31.16 v3.38,30.16 | Q4.1 8.2,30.66 v7.7,30.16 v8.72,30.16 | Q4.2 8.96,31.04 v8.72,30.16 | v4.4,30.16 v3.38,30.16 | v3.38,30.16 v2.37,30.16 | v8.72,30.16 v9.73,30.16 10.23,31.29 Q4.3 10.37,31.62 10.88,30.16 | v10.75,30.16 10.88,30.16 | 10.88,30.04 10.88,30.16 | Q6.1 15.42,34.96 v15.45,34.1 | Q6.2 16.69,35.21 v16.46,34.1 v15.45,34.1 | Q6.3 17.96,35.47 v17.48,34.1 | v15.45,34.1 v17.48,34.1 | v17.48,34.1 v18.49,34.1
  Bottom 0.254: v1.22,16.19 v1.22,17.59 | C12.1 16.42,16.91 v16.46,17.97 | C11.2 1.48,10.35 v1.22,10.1 | R50.1 28.31,13.23 v28.27,13.27 | v28.53,16.06 28.53,15.94 | 9.22,18.99 9.22,18.48 9.1,18.35 8.34,18.35 7.32,18.35 C8.1
  Bottom 0.305: 28.53,15.94 28.27,15.68 v28.27,13.27 28.27,13.14
  Bottom 0.406: 9.1,18.73 9.1,19.11 9.22,18.99 9.14,18.99 DRV2.4 9.11,19 8.46,18.35 8.34,18.35 7.19,18.35 | DRV3.4 16.72,21.3 16.72,19.49 15.76,18.54 C5.1 15.77,18.54 v16.46,18.99 | C6.1 23.18,20.02 v23.45,20 | R21.2 28.2,27.21 C4.2 28.15,29.2 28.15,31.3 27.85,31.6 SENSE.5 27,31.65 v27,33.97 | DRV1.4 1.67,18.03 v1.22,17.59 | C8.1 7.18,17.58 6.94,17.34 v6.3,17.34
  pour Top (no thermals): 0.84,32.7 13.29,32.7 13.29,36.77 19.89,36.77 19.89,28.77 0.84,28.77
  pour Route2 (isolate 0.254, no thermals): 0.71,37.15 29.29,37.15 29.29,0.82 0.71,0.82
  pour Top: 0.71,27.5 19.76,27.5 21.42,29.15 21.42,35.5 29.16,35.5 29.16,0.7 0.97,0.7 0.71,0.7
  pour Route2 (isolate 0.406, no thermals): 0.71,47.18 29.29,47.18 29.29,36.77 9.35,36.77 9.35,36.89 8.84,36.89 8.84,36.77 4.14,36.77 4.27,36.64 0.71,36.64
  pour Route15: 0.84,36.39 29.29,36.39 29.29,0.82 0.84,0.82
  pour Route15 (isolate 0.406, no thermals): 0.71,47.18 20.02,47.05 20.02,43.88 22.05,41.85 24.46,41.85 24.46,35.88 0.71,35.88
  pour Bottom: 0.71,47.18 12.02,47.18 12.02,44 0.71,44
  pour Bottom: 0.84,30.67 13.03,30.67 15.19,32.83 15.19,34.35 29.29,34.35 29.29,0.7 0.84,0.7
  pour Top (no thermals): 0.71,47.18 12.78,47.18 12.78,44.51 0.71,44.51
BUTTON
  Top 0.254: BUT.P$4 BUT.P$2 28.53,25.18 28.53,25.84 28.15,26.23 26.24,26.23 25.23,25.21 24.59,25.21 | UC1.44 12.85,23.11 13.16,22.8 16.08,22.8 16.35,23.07 UC1.37 16.35,24.08 16.46,24.19 17.22,24.19 18.24,25.21 24.08,25.21 | 24.08,25.21 24.59,25.21 | 24.21,23.43 24.34,23.3 24.46,23.3 24.46,23.18 24.36,23.29 R48.1 24.34,23.68 24.36,23.7 24.36,24.94 24.34,24.95 | 24.08,25.21 24.34,24.95 | 24.34,24.95 24.59,25.21
CS  (via drill 0.4 pad 0.81)
  Top 0.254: UC1.38 15.85,24.73 16.59,25.46 16.59,26.48 v16.21,26.86
  Route15 0.254: 12.25,2.5 11.76,2.98 10.37,2.98 5.29,7.94 5.29,20.38 7.57,22.67 14.05,22.67 16.59,25.08 16.59,26.48 v16.21,26.86
  Route15 1.016: LOGIC.5 12.25,2.5
CUR  (via drill 0.4 pad 0.81)
  Top 0.254: UC1.17 12.85,12.44 13.16,12.13 v15.07,12.13
  Route15 0.305: v24.34,26.23 24.21,26.1 v24.21,17.97
  Bottom 0.305: R21.1 24.43,27.12 R20.2 24.34,27.22 v24.34,26.23
  Bottom 0.406: v15.07,12.13 20.91,12.13 24.21,15.43 v24.21,17.97
DISC  (via drill 0.4 pad 0.81)
  Top 0.254: UC1.46 11.85,23.22 12.53,22.54 12.78,22.54 v13.54,21.78 13.67,21.65
  Route15 0.254: v27.26,10.35 25.35,10.35 19.64,16.06 12.4,16.06 11.89,16.57 11.89,19.49 13.54,21.14 v13.54,21.78
  Bottom 0.254: R28.1 28.22,10.4 R50.2
  Bottom 0.406: R50.2 27.35,10.44 v27.26,10.35
ENC_CS
  Top 0.254: UC1.25 18.13,16.94 18.37,16.7 18.37,13.14 17.35,12.13 | 17.35,10.98 ENCODER.3
  Top 0.813: 17.35,10.98 17.35,12.13
ENC_MISO
  Top 0.254: UC1.27 18.91,17.94 19.51,17.34 19.51,14.41 21.88,12.04
  Top 0.813: ENCODER.6 21.88,12.04
ENC_MOSI
  Top 0.254: 20.38,10.24 20.78,9.84 22.43,9.84 22.94,10.35 22.94,12.51 20.15,15.56 20.15,17.46 19.17,18.44 UC1.28
  Top 0.813: ENCODER.5 20.38,10.24
ENC_SCK
  Top 0.254: UC1.26 18.65,17.44 18.88,17.21 18.88,11.62 | ENCODER.4
  Top 0.813: ENCODER.4 18.88,11.62 18.88,12
HALLU
  Top 0.254: UC1.14 11.35,10 13.16,8.19 18.11,8.19 19.13,7.17 | 19.13,5.76 19.13,5.65 19,5.65 | HALL.3 19.13,5.76 | 19.13,5.76 19.13,5.78
  Top 0.813: 19.13,7.17 19.13,5.78
HALLV
  Top 0.254: UC1.15 11.85,10.39 13.54,8.7 18.88,8.7 20.58,6.99
  Top 0.813: 20.58,6.99 HALL.4
HALLW
  Top 0.254: UC1.16 12.35,11.03 14.05,9.33 19.64,9.33 22.08,6.89
  Top 0.813: 22.08,6.89 HALL.5
LED  (via drill 0.4 pad 0.81)
  Top 0.254: R36.1 22.73,28.3 v22.56,28.26 | UC1.34 21.03,21.44 22.56,19.88 v22.56,18.73
  Route15 0.254: v22.56,28.26 v22.56,18.73
MISO  (via drill 0.4 pad 0.81)
  Top 0.254: UC1.40 14.85,26.82 v14.81,26.86
  Route15 0.254: v14.81,26.86 13.92,26.86 11.64,24.57 5.16,24.57 2.87,22.29 2.87,5.78 4.65,4 | 4.65,1.48 LOGIC.8
  Route15 1.016: 4.65,1.48 4.65,4
MOSI  (via drill 0.4 pad 0.81)
  Top 0.254: UC1.41 14.35,25.41 v14.05,25.72
  Route15 0.254: 7.19,2.73 3.64,6.29 3.64,21.53 6.05,23.94 12.27,23.94 v14.05,25.72 | 7.19,1.33 7.19,1.43 LOGIC.7
  Route15 1.016: 7.19,1.43 7.19,2.73
N$2  (via drill 0.4 pad 0.81)
  Route15 0.406: v11.64,38.16 11.89,37.78 11.89,29.02 11.38,28.51 v8.08,28.51
  Bottom 0.305: 9.61,28.64 9.61,28.66 R3.2
  Bottom 0.406: Q3.4 11.6,38.12 v11.64,38.16 | v8.08,28.51 8.21,28.64 9.61,28.64 9.73,28.77 | D7.2 9.79,28.85 R3.2
N$3
  Top 0.305: 5.03,28.77 5.03,28.71 D9.2
  Top 0.406: R2.2 3.24,28.68 D9.2 | Q2.4 5.52,29.63 5.03,29.15 5.03,28.77 5.16,28.64
N$4
  Bottom 0.406: DRV1.2 4.21,17.3 R7.2
N$5
  Bottom 0.406: DRV1.8 | DRV1.8 5.67,24.19 7.13,24.19 D6.1 7.07,24.3 7.07,24.45 6.43,25.08 C1.1
N$6
  Top 0.406: Q4.4 11.5,30.81 12.4,29.91 12.4,29.15 D8.2 12.37,29.12 11.89,28.64 10.62,28.64 R4.2
N$7  (via drill 0.4 pad 0.81)
  Route15 0.406: v14.81,31.94 18.37,31.94 20.02,33.59 20.02,42.48 v19.26,43.24
  Bottom 0.406: v19.26,43.24 19.26,41.55 Q5.4 | v14.81,31.94 16.19,31.94 D10.2 16.6,31.54 R5.2
N$8
  Bottom 0.406: DRV1.3 2.94,16.76 3.13,16.57 3,16.57 R8.2
N$9
  Top 0.406: Q6.4 19.23,35.14 19.64,34.73 19.64,33.59 19.13,33.08 19.13,32.35 R6.2 17.46,32.33 D11.2
N$10
  Bottom 0.406: DRV2.8 14.53,24.08 D2.1 13.13,24.16 13.03,24.07 12.91,24.07 12.91,26.86 13.67,27.62 C2.1
N$11  (via drill 0.4 pad 0.81)
  Route15 0.406: v5.67,38.16 5.67,29.78 4.53,28.64 v1.22,28.64
  Bottom 0.305: 2.49,28.51 2.51,28.51 R1.2
  Bottom 0.406: Q1.4 5.54,38.04 v5.67,38.16 | D1.2 2.72,28.73 2.49,28.51 | 2.49,28.51 2.62,28.51 | 2.49,28.51 1.48,28.51 v1.22,28.64
N$12
  Bottom 0.406: D10.1 16.47,29.74 R5.1 20.22,27.8 DRV3.7
N$13  (via drill 0.4 pad 0.81)
  Top 0.406: R6.1 17.53,30.53 D11.1 16.93,30.25 16.46,29.78 v16.46,28.26
  Bottom 0.406: DRV3.5 17.68,27.04 v16.46,28.26
N$14
  Bottom 0.406: DRV2.3 10.4,17.49 9.86,16.95 9.87,16.95 R10.2
N$15
  Bottom 0.406: C3.1 20.78,29.61 20.78,28.77 21.49,28.05 DRV3.8 21.45,26.48 21.42,26.48 21.54,26.35 21.54,25.46 21.83,25.18 D3.1
N$16
  Bottom 0.406: 12.14,16.43 R9.2 11.67,16.87 DRV2.2
N$17
  Bottom 0.406: DRV3.2 20.22,19.42 21.03,18.61 21.03,17.25 R11.2
N$18
  Bottom 0.406: DRV3.3 18.95,17.39 19,17.34 19,17.21 | 19,17.21 19,17.08 | R12.2 19.01,17.2 19,17.21
N$22  (via drill 0.4 pad 0.81)
  Top 0.254: REG1.1 7.65,12.43 v8.53,11.56 | 8.72,11.37 9.48,11.37 | 9.61,11.37 9.86,11.37 9.99,11.49 9.61,11.49 9.48,11.37 | v28.65,7.3 28.65,6.29 28.78,6.16 28.78,5.14 28.8,5.14 D12.1 | 9.48,11.37 9.61,11.37 | 9.61,11.37 C13.1
  Top 0.305: v8.53,11.56 8.72,11.37
  Route15 0.305: v28.65,7.3 28.27,7.43 16.08,7.43 12.02,11.49 8.59,11.49 v8.53,11.56
  Bottom 0.406: v28.65,7.3 29.04,6.92 29.04,6.07 JP2.2
N$24
  Bottom 0.406: SENSE.7 24.42,29.16 R20.1
N$27
  Bottom 0.406: SENSE.6 25.69,29.86 C4.1
N$29
  Top 0.254: D4.A 27.45,29.59 27,30.04 25.03,30.04 R36.2
N$59
  Top 0.254: R29.1 24.45,10.21 23.83,9.59 23.83,7.94 24.34,7.43 27.13,7.43 27.77,6.79 27.77,4.76 27.51,4.51 26.88,4.51 26.88,4.53 K1.2
N$60
  Bottom 0.406: R35.1 24.02,6.09 24.97,5.14 25.84,5.14 K1.3
OSC_IN
  Top 0.254: UC1.5 3.96,20.44 2.49,21.91 | 2.49,21.91 2.37,22.03 2.43,22.03 OSC.3 | C21.2 2.86,24.31 2.49,23.94 2.49,21.91
OSC_OUT
  Top 0.254: UC1.6 6.37,19.94 4.91,18.48 4.91,18.35 OSC.1 4.83,16.62 4.53,16.32 4.65,16.32 4.78,16.19 4.78,16.32 4.76,16.3 C20.2
RESET  (via drill 0.4 pad 0.81)
  Top 0.254: UC1.7 12.07,19.44 v14.05,17.46 | RESET.P$2 27,16.07 | RESET.P$4 27,14.93 27,14.92 RESET.P$2 | 26.88,14.67 27,14.79 RESET.P$2 | v25.73,15.56 25.73,15.43 26.37,14.79 26.99,14.79 RESET.P$2 | RESET.P$2
  Route15 0.254: v14.05,17.46 14.43,17.08 20.02,17.08 21.54,15.56 v25.73,15.56
  Bottom 0.406: v25.73,15.56 25.73,17.34 26.5,18.1 27.72,18.1 R40.2
SCK  (via drill 0.4 pad 0.81)
  Top 0.254: UC1.39 15.35,25.5 v15.57,25.72
  Route15 0.254: 9.71,2.25 4.53,7.43 4.53,21.02 6.81,23.3 13.16,23.3 v15.57,25.72
  Route15 1.016: LOGIC.6 9.71,2.25
U_GATE_HIGH
  Bottom 0.406: DRV1.7 4.21,25.27 4.53,25.59 4.53,26.39 D1.1 4.24,26.77 R1.1
U_GATE_LOW  (via drill 0.4 pad 0.81)
  Top 0.305: 3.22,26.88 3.22,26.95 3.25,26.99
  Top 0.406: 3.22,26.88 R2.1 2.26,26.88 1.6,26.23 v1.6,25.34 | D9.1 5.01,26.5 4.65,26.86 3.25,26.86 3.25,26.99
  Bottom 0.61: DRV1.5 1.67,25.27 v1.6,25.34
U_HIGH  (via drill 0.4 pad 0.81)
  Top 0.254: UC1.10 8.18,17.94 7.57,17.34 v7.57,15.43
  Bottom 0.406: R7.1 6.9,14.76 v7.57,15.43
U_LOW  (via drill 0.4 pad 0.81)
  Top 0.254: UC1.11 8.56,17.44 8.34,17.21 8.34,14.41 v8.21,14.29
  Bottom 0.406: R8.1 3.04,13.87 3.38,13.53 7.45,13.53 v8.21,14.29
U_PHASE  (via drill 0.4 pad 0.81)
  Top 0.406: 3.89,34.48 5.92,33.46 6.43,32.96 v6.43,28.89
  Top 0.61: 5.29,36.47 Q2.MB 4.25,34.84 3.89,34.48
  Route15 0.406: v3,25.34 3,25.46 v6.43,28.89
  Bottom 0.406: DRV1.6 2.94,25.02 v3,25.34 | C1.2 6.43,28.77 v6.43,28.89
  Bottom 0.61: Q1.1 1.74,37.46 2.78,38.51 | 2.78,38.51 3.73,39.46 | 3.73,39.46 X2.1 | Q1.2 3,38.29 2.78,38.51 | Q1.3 4.28,38.92 3.73,39.46
  pour Bottom (no thermals): 0.97,42.73 5.92,42.73 5.92,36 0.97,36
  pour Top (no thermals): 0.97,42.73 5.92,42.73 5.92,33.34 0.97,33.34
USBDM
  Top 0.254: UC1.32 19.96,20.44 21.03,19.37 21.03,17.34 24.45,13.92 R29.2
USBDP  (via drill 0.4 pad 0.81)
  Top 0.254: UC1.33 20.23,20.94 21.54,19.62 21.54,18.1 v26.37,13.27
  Bottom 0.406: R35.2 R28.2 | 26.11,12.26 26.24,12.26 R28.2 | v26.37,13.27 26.37,12.38 R28.2
V+  (via drill 0.4 pad 0.81)
  Route15 0.406: v25.23,19.11 25.61,19.37 25.61,38.05 C10.+
  Bottom 0.406: v25.23,19.11 25.23,20.33 JP1.1
  Bottom 0.61: SENSE.3 26.24,36.53 | 26.24,36.53 SENSE.4 | V+.1 27.09,40.17 C10.+ 26.11,36.66 26.24,36.53
  Bottom 2: V+.3 V+.2 V+.1
  pour Bottom (no thermals): 20.4,47.05 29.04,47.05 29.04,35.37 25.23,35.37 25.23,39.31 25.1,39.31 20.4,44
  pour Top (no thermals): 20.4,47.05 29.04,47.05 29.04,37.78 25.1,37.78 25.1,39.18 20.4,44
  pour Route15 (no thermals): 20.91,47.18 29.16,47.18 29.16,37.02 25.48,37.02 25.48,42.73 22.56,42.73 20.91,44.39
V+_MOS
  Bottom 0.61: SENSE.2 SENSE.1 22.54,36.53 20.91,38.16 17.65,38.16 Q5.MB 15.04,37.88 13.54,36.39 13.54,34.61 12.78,33.84 10.37,33.84 9.86,33.34 9.73,33.34 9.73,33.21 | Q3.MB 4.4,33.21 4.27,33.34 3.74,33.34 Q1.MB
  pour Bottom (no thermals): 0.84,35.37 12.4,35.37 12.4,38.42 14.56,38.42 14.56,39.81 22.43,39.81 24.46,37.78 24.46,35.37 14.94,35.37 14.3,34.61 14.3,32.83 13.03,31.43 0.84,31.43
V_GATE_HIGH
  Bottom 0.406: R3.1 11.46,26.91 D7.1 11.82,25.77 11.64,25.59 11.64,24.11 DRV2.7
V_GATE_LOW  (via drill 0.4 pad 0.81)
  Top 0.406: D8.1 10.64,26.82 R4.1 9.62,26.88 9.1,26.35 v9.1,25.46
  Bottom 0.406: DRV2.5 9.13,25.43 v9.1,25.46
V_HIGH  (via drill 0.4 pad 0.81)
  Top 0.254: UC1.12 9.35,13.52 v9.35,13.02
  Bottom 0.406: R9.1 11.74,13.51 11.26,13.02 v9.35,13.02
V_LOW  (via drill 0.4 pad 0.81)
  Top 0.254: 10.75,13.91 v10.49,14.03 10.85,14.39 UC1.13
  Bottom 0.406: R10.1 9.93,14.6 v10.49,14.03
V_PHASE  (via drill 0.4 pad 0.81)
  Top 0.406: Q4.MB 11.6,35.41 | 9.61,36.26 9.86,36 10.49,36 12.14,33.84 13.16,32.83 v13.16,31.81
  Top 0.61: X2.2 7.83,38.31 Q4.MB
  Route15 0.406: v10.37,25.46 10.37,26.1 13.16,28.89 v13.16,31.81 13.29,31.94 13.29,31.81
  Bottom 0.406: DRV2.6 10.4,25.43 v10.37,25.46 | C2.2 13.67,31.3 v13.16,31.81
  Bottom 0.61: X2.2 7.83,38.92 7.79,37.83 Q3.1 Q3.2 | Q3.3 Q3.2 | Q3.2 8.75,36.86 8.59,37.02 8.9,37.02 Q3.2
  pour Top (no thermals): 6.56,42.73 9.1,42.73 9.1,38.67 12.65,38.67 12.65,33.34 6.56,33.34
  pour Bottom (no thermals): 6.56,42.73 9.1,42.73 9.1,38.67 10.75,38.67 10.75,36 6.56,36
VCC  (via drill 0.4 pad 0.81)
  Top 0.406: v22.69,30.04 22.69,31.43 C9.1
  Route15 0.305: v22.69,30.04 21.54,30.04 20.78,29.27 20.78,17.97 22.05,16.7 26.75,16.7 27.51,15.94 27.51,12.13 28.65,10.98 v28.65,8.7
  Bottom 0.254: 19.89,2.6 19.89,1.48 LOGIC.2 | JP2.1 28.16,5.92 28.15,5.9
  Bottom 0.305: D5.1 28.66,4.52
  Bottom 0.406: SENSE.8 23.15,30.5 v22.69,30.04 | ENCODER.2 15.96,10.94 15.96,8.83 17.58,7.2 HALL.2 17.61,5.69 17.61,4.89 19.87,2.63 19.87,2.58 | D5.1 28.54,4.63 28.15,5.02 28.15,5.9 28.15,6.03 | JP2.1 28.16,6.4 27.77,6.79 27.77,7.81 v28.65,8.7 | 28.66,4.52 28.66,4.39 27.13,2.86 23.83,2.86 23.45,3.24 20.53,3.24 19.89,2.6 19.89,1.71
  Bottom 0.813: LOGIC.2 19.87,2.58 19.89,2.6
VDRIVER
  Bottom 0.406: 14.69,21.78 14.56,21.65 14.56,21.02 14.73,20.84 C5.2 14.69,20.38 12.91,20.38 | 14.69,21.78 15.83,21.78 17.22,23.3 21.54,23.3 | 21.54,23.3 21.54,21.41 DRV3.1 | JP1.2 25.22,22.86 | 25.22,22.86 D3.2 | 21.54,23.3 22.94,23.3 23.18,23.07 | 23.18,23.07 23.19,23.05 | 25.22,22.86 25.16,22.86 24.97,23.05 23.19,23.05 C6.2 23.18,23.07 | DRV1.1 5.48,20.83 5.79,21.14 7.07,21.14 | 7.07,21.14 7.07,21.91 | C8.2 7.18,21.03 7.07,21.14 | C8.2 7.18,21.89 D6.2 | C8.2 7.99,20.29 8.46,20.76 12.53,20.76 12.91,20.38 | 12.91,20.38 12.91,19.03 DRV2.1 12.91,18.97 12.91,9.08 14.81,7.17 14.81,2.98 | D2.2 14.69,21.78
  Bottom 0.813: LOGIC.4 14.79,2.96 14.81,2.98
VUSB  (via drill 0.4 pad 0.81)
  Top 0.254: K1.1 25.89,3.33 26.37,2.86 D12.2
  Top 0.305: D12.2 28.82,1.5 v28.65,1.46
  Bottom 0.254: D5.2 28.66,2.34 28.65,2.35
  Bottom 0.305: v28.65,1.46 28.78,2.09 28.53,2.35 28.65,2.35
W_HIGH  (via drill 0.4 pad 0.81)
  Top 0.254: UC1.18 13.35,13.59 v13.92,13.02
  Bottom 0.406: v13.92,13.02 20.15,13.02 21.16,14.03 21.16,15.32 R11.1
W_LOW  (via drill 0.4 pad 0.81)
  Top 0.254: UC1.19 13.85,14.74 v14.69,13.91
  Bottom 0.406: v14.69,13.91 18.49,13.91 19,14.41 R12.1
W_PHASE  (via drill 0.4 pad 0.81)
  Top 0.406: Q6.MB 18.33,39.47 | v20.78,33.08 20.78,36.89 18.88,38.8 18.75,38.8 18.11,39.43
  Top 0.61: X2.3 15.78,41.02 Q6.MB
  Route15 0.406: v18.24,28.38 18.24,30.54 v20.78,33.08
  Bottom 0.406: DRV3.6 18.95,27.67 v18.24,28.38 | C3.2 20.81,33.05 v20.78,33.08
  Bottom 0.61: Q5.3 Q5.2 Q5.1 10.89,41.53 X2.3
  pour Top (no thermals): 9.73,42.73 20.15,42.73 20.15,37.4 13.42,37.4 13.42,39.31 9.73,39.31
  pour Bottom (no thermals): 9.73,42.73 18.62,42.73 18.62,40.58 13.8,40.58 13.8,39.31 9.73,39.31

### Text on the board
bNames: GND | MISO | MOSI | SCK | CS | VDRIVER | 3.3 | VCC | GND
_bsilk: rev2